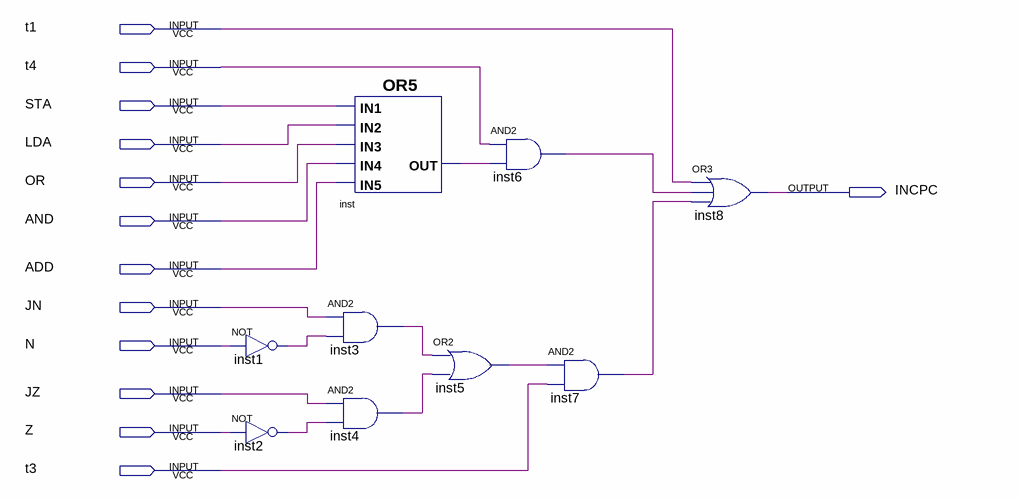
[diagram p0: schematic sheet]
// Quartus schematic IncrementaPC.bdf as structural Verilog: 9 symbols, 13 pins
module IncrementaPC (
  input  t1,
  input  t4,
  input  STA,
  input  LDA,
  input  OR,
  input  AND,
  input  ADD,
  input  JN,
  input  N,
  input  JZ,
  input  Z,
  input  t3,
  output INCPC
);

  wire inst1_out, inst2_out, inst3_out, inst4_out, inst5_out, inst6_out, inst7_out, inst_out;

  not inst1 (inst1_out, N);
  not inst2 (inst2_out, Z);
  or inst (inst_out, STA, LDA, OR, AND, ADD);
  and inst3 (inst3_out, JN, inst1_out);
  and inst4 (inst4_out, JZ, inst2_out);
  or inst5 (inst5_out, inst3_out, inst4_out);
  and inst6 (inst6_out, t4, inst_out);
  and inst7 (inst7_out, inst5_out, t3);
  or inst8 (INCPC, t1, inst6_out, inst7_out);
endmodule
